# Altium schematic sheet LINK_PIC.SchDoc
size C
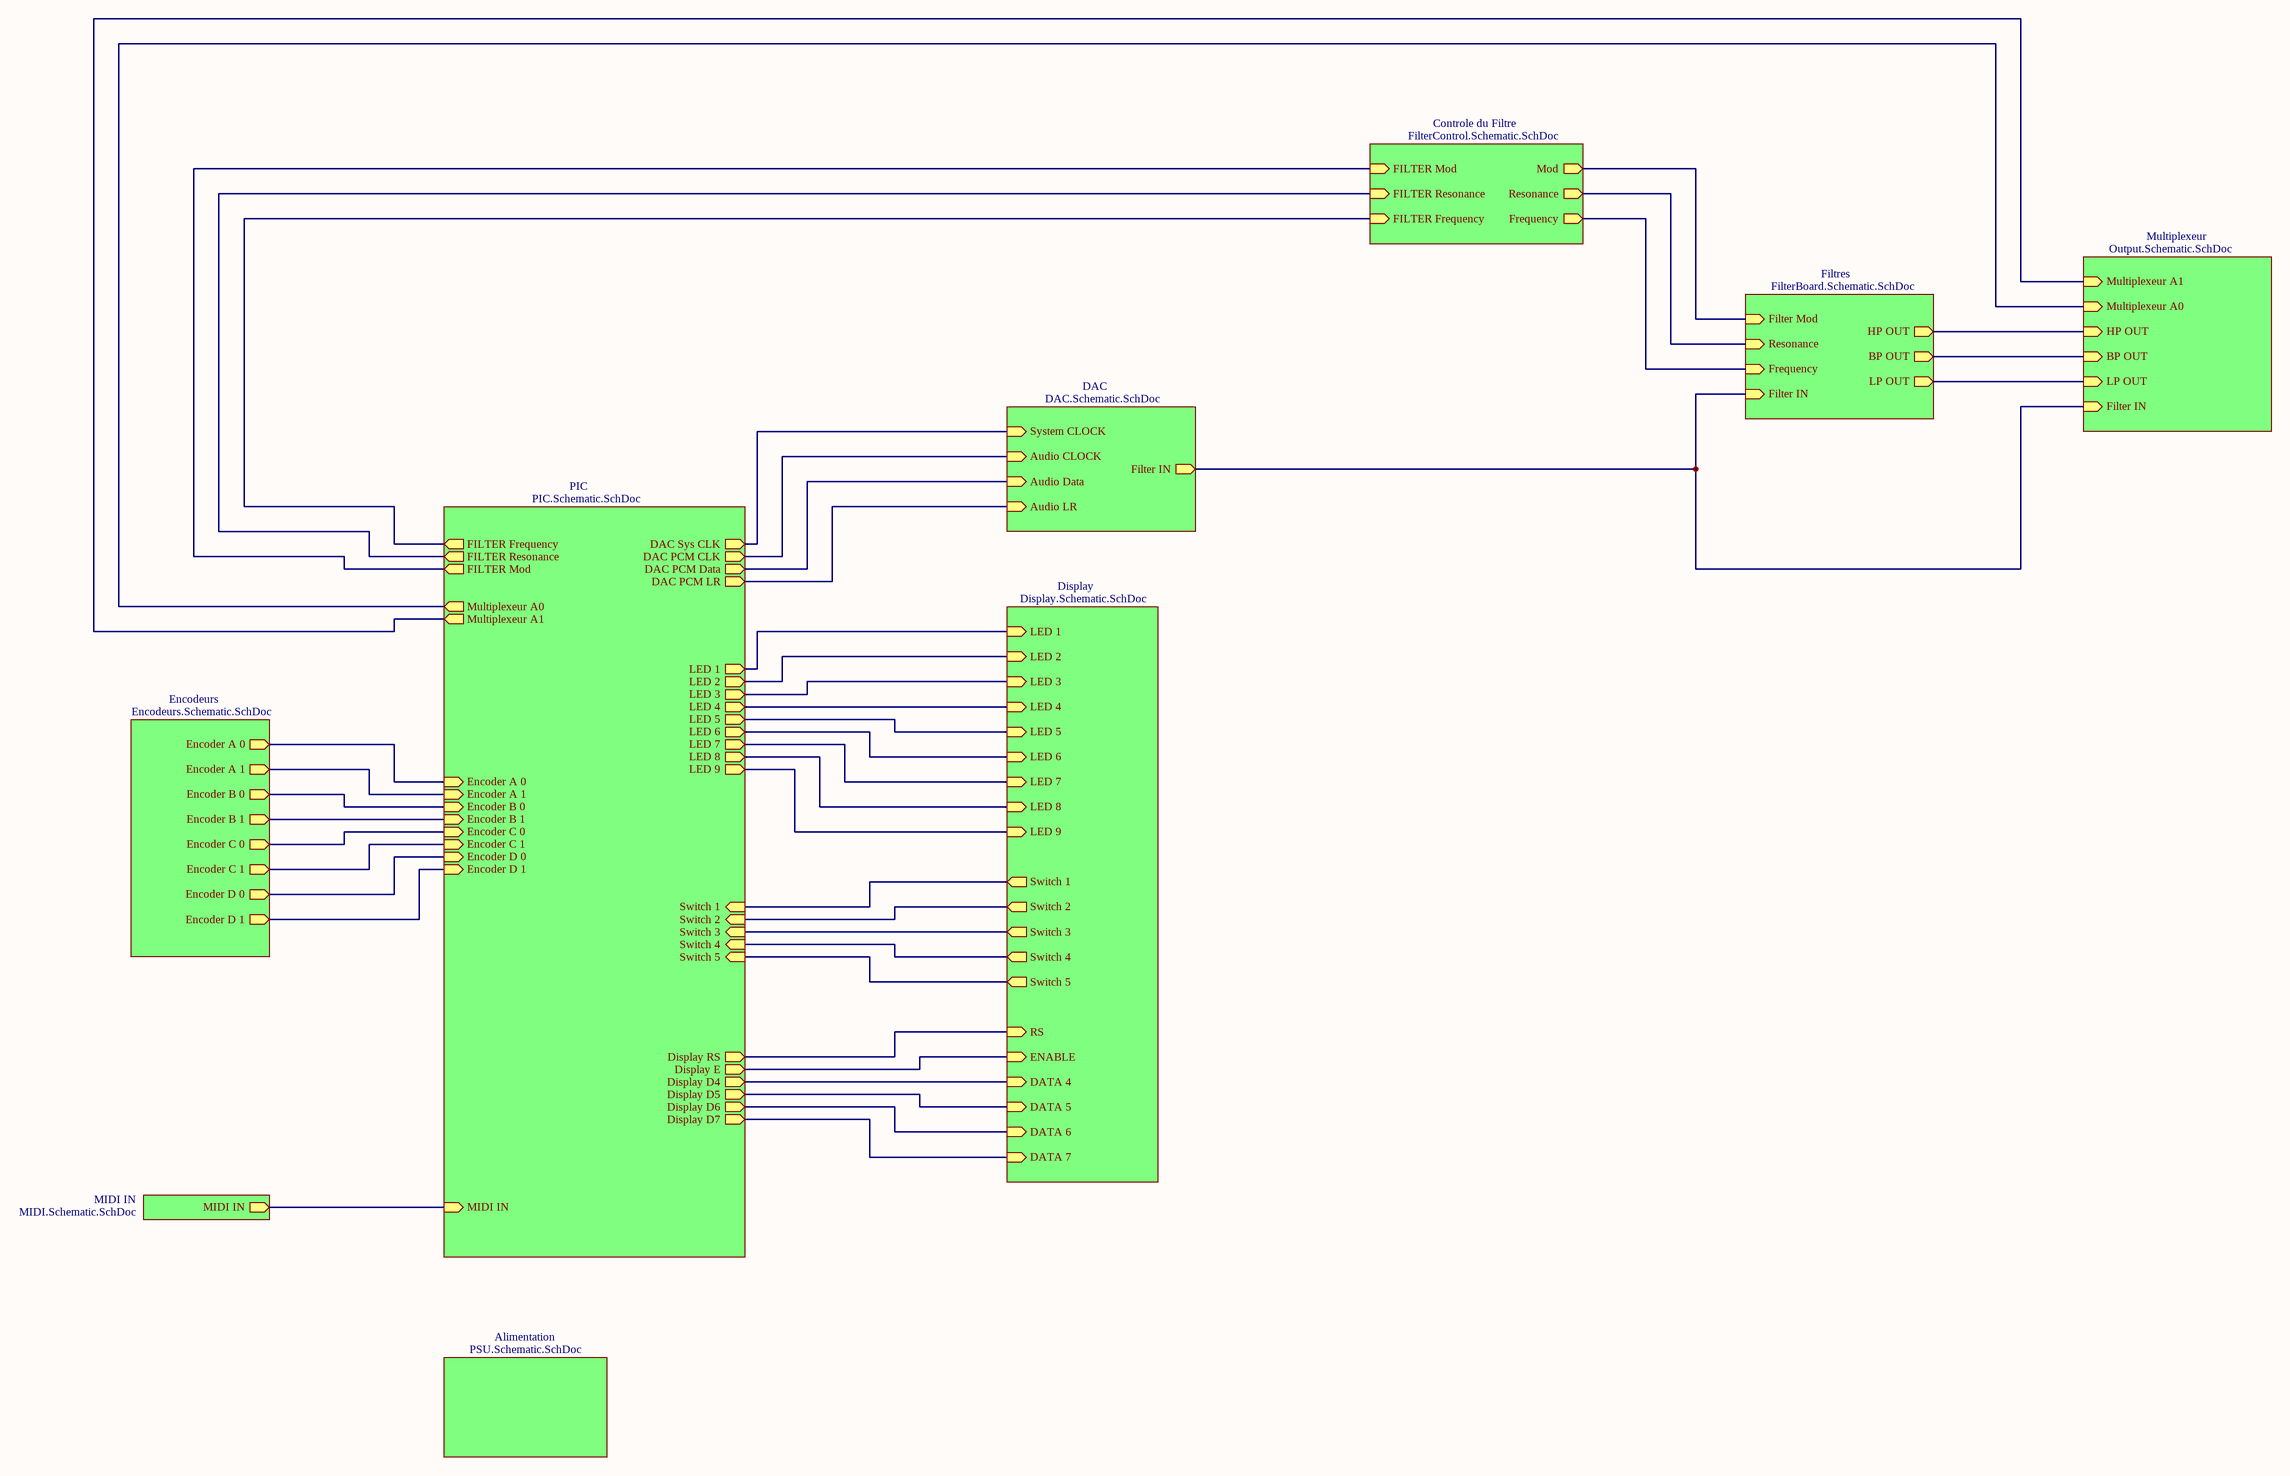
[diagram p0: LINK_PIC.SchDoc]

## Sub-sheets
Alimentation = PSU.Schematic.SchDoc: no entries
Controle du Filtre = FilterControl.Schematic.SchDoc: Frequency (out), Resonance (out), Mod (out), FILTER Frequency (in), FILTER Resonance (in), FILTER Mod (in)
DAC = DAC.Schematic.SchDoc: Filter IN (out), System CLOCK (in), Audio Data (in), Audio CLOCK (in), Audio LR (in)
Display = Display.Schematic.SchDoc: LED 1 (in), LED 2 (in), LED 3 (in), LED 4 (in), LED 5 (in), LED 6 (in), LED 7 (in), LED 8 (in), LED 9 (in), Switch 1 (out), Switch 2 (out), Switch 3 (out), Switch 4 (out), Switch 5 (out), RS (in), ENABLE (in), DATA 4 (in), DATA 5 (in), DATA 6 (in), DATA 7 (in)
Encodeurs = Encodeurs.Schematic.SchDoc: Encoder A 0 (out), Encoder A 1 (out), Encoder B 0 (out), Encoder B 1 (out), Encoder C 0 (out), Encoder C 1 (out), Encoder D 0 (out), Encoder D 1 (out)
Filtres = FilterBoard.Schematic.SchDoc: Filter IN (in), Filter Mod (in), Frequency (in), Resonance (in), BP OUT (out), HP OUT (out), LP OUT (out)
MIDI IN = MIDI.Schematic.SchDoc: MIDI IN (out)
Multiplexeur = Output.Schematic.SchDoc: Filter IN (in), BP OUT (in), HP OUT (in), LP OUT (in), Multiplexeur A0 (in), Multiplexeur A1 (in)
PIC = PIC.Schematic.SchDoc: LED 2 (out), LED 1 (out), LED 4 (out), LED 3 (out), LED 6 (out), LED 5 (out), LED 8 (out), LED 7 (out), LED 9 (out), DAC Sys CLK (out), DAC PCM CLK (out), DAC PCM Data (out), DAC PCM LR (out), Switch 1 (in), Switch 2 (in), Switch 3 (in), Switch 4 (in), Switch 5 (in), Display D4 (out), Display D5 (out), Display D6 (out), Display D7 (out), Display E (out), Display RS (out), MIDI IN (in), FILTER Frequency (out), FILTER Resonance (out), FILTER Mod (out), Multiplexeur A0 (out), Multiplexeur A1 (out), Encoder A 0 (in), Encoder A 1 (in), Encoder B 0 (in), Encoder B 1 (in), Encoder C 0 (in), Encoder C 1 (in), Encoder D 0 (in), Encoder D 1 (in)

## Nets
(unnamed): sheet Filtres/Filter IN, sheet Multiplexeur/Filter IN, sheet DAC/Filter IN
(unnamed): sheet Filtres/Filter Mod, sheet Controle du Filtre/Mod
(unnamed): sheet Filtres/Frequency, sheet Controle du Filtre/Frequency
(unnamed): sheet Filtres/Resonance, sheet Controle du Filtre/Resonance
(unnamed): sheet Filtres/BP OUT, sheet Multiplexeur/BP OUT
(unnamed): sheet Filtres/HP OUT, sheet Multiplexeur/HP OUT
(unnamed): sheet Filtres/LP OUT, sheet Multiplexeur/LP OUT
(unnamed): sheet Multiplexeur/Multiplexeur A0, sheet PIC/Multiplexeur A0
(unnamed): sheet Multiplexeur/Multiplexeur A1, sheet PIC/Multiplexeur A1
(unnamed): sheet DAC/System CLOCK, sheet PIC/DAC Sys CLK
(unnamed): sheet DAC/Audio Data, sheet PIC/DAC PCM Data
(unnamed): sheet DAC/Audio CLOCK, sheet PIC/DAC PCM CLK
(unnamed): sheet DAC/Audio LR, sheet PIC/DAC PCM LR
(unnamed): sheet Controle du Filtre/FILTER Frequency, sheet PIC/FILTER Frequency
(unnamed): sheet Controle du Filtre/FILTER Resonance, sheet PIC/FILTER Resonance
(unnamed): sheet Controle du Filtre/FILTER Mod, sheet PIC/FILTER Mod
(unnamed): sheet MIDI IN/MIDI IN, sheet PIC/MIDI IN
(unnamed): sheet PIC/LED 2, sheet Display/LED 2
(unnamed): sheet PIC/LED 1, sheet Display/LED 1
(unnamed): sheet PIC/LED 4, sheet Display/LED 4
(unnamed): sheet PIC/LED 3, sheet Display/LED 3
(unnamed): sheet PIC/LED 6, sheet Display/LED 6
(unnamed): sheet PIC/LED 5, sheet Display/LED 5
(unnamed): sheet PIC/LED 8, sheet Display/LED 8
(unnamed): sheet PIC/LED 7, sheet Display/LED 7
(unnamed): sheet PIC/LED 9, sheet Display/LED 9
(unnamed): sheet PIC/Switch 1, sheet Display/Switch 1
(unnamed): sheet PIC/Switch 2, sheet Display/Switch 2
(unnamed): sheet PIC/Switch 3, sheet Display/Switch 3
(unnamed): sheet PIC/Switch 4, sheet Display/Switch 4
(unnamed): sheet PIC/Switch 5, sheet Display/Switch 5
(unnamed): sheet PIC/Display D4, sheet Display/DATA 4
(unnamed): sheet PIC/Display D5, sheet Display/DATA 5
(unnamed): sheet PIC/Display D6, sheet Display/DATA 6
(unnamed): sheet PIC/Display D7, sheet Display/DATA 7
(unnamed): sheet PIC/Display E, sheet Display/ENABLE
(unnamed): sheet PIC/Display RS, sheet Display/RS
(unnamed): sheet PIC/Encoder A 0, sheet Encodeurs/Encoder A 0
(unnamed): sheet PIC/Encoder A 1, sheet Encodeurs/Encoder A 1
(unnamed): sheet PIC/Encoder B 0, sheet Encodeurs/Encoder B 0
(unnamed): sheet PIC/Encoder B 1, sheet Encodeurs/Encoder B 1
(unnamed): sheet PIC/Encoder C 0, sheet Encodeurs/Encoder C 0
(unnamed): sheet PIC/Encoder C 1, sheet Encodeurs/Encoder C 1
(unnamed): sheet PIC/Encoder D 0, sheet Encodeurs/Encoder D 0
(unnamed): sheet PIC/Encoder D 1, sheet Encodeurs/Encoder D 1